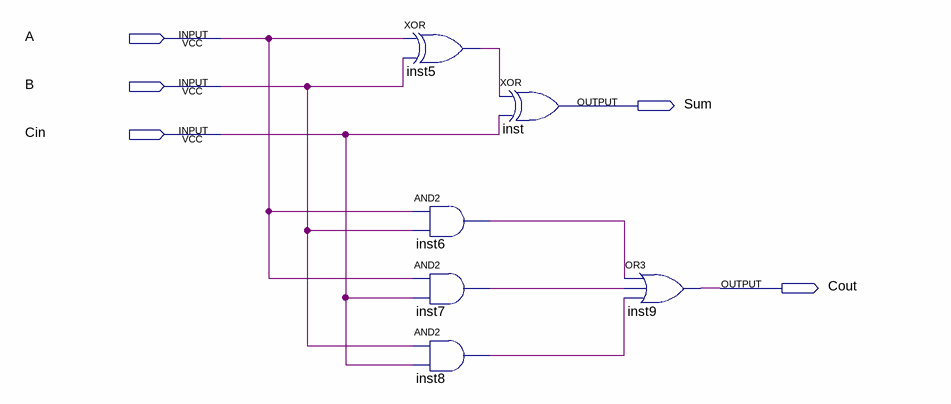
[diagram p0: schematic sheet]
// Quartus schematic 1bitAdder.bdf as structural Verilog: 6 symbols, 5 pins
module \1bitAdder  (
  input  A,
  input  B,
  input  Cin,
  output Sum,
  output Cout
);

  wire inst5_out, inst6_out, inst7_out, inst8_out;

  xor inst5 (inst5_out, A, B);
  and inst6 (inst6_out, A, B);
  and inst7 (inst7_out, A, Cin);
  and inst8 (inst8_out, B, Cin);
  xor inst (Sum, inst5_out, Cin);
  or inst9 (Cout, inst6_out, inst7_out, inst8_out);
endmodule
